# EAGLE design Layer2_v1.1 (EAGLE 6.2)
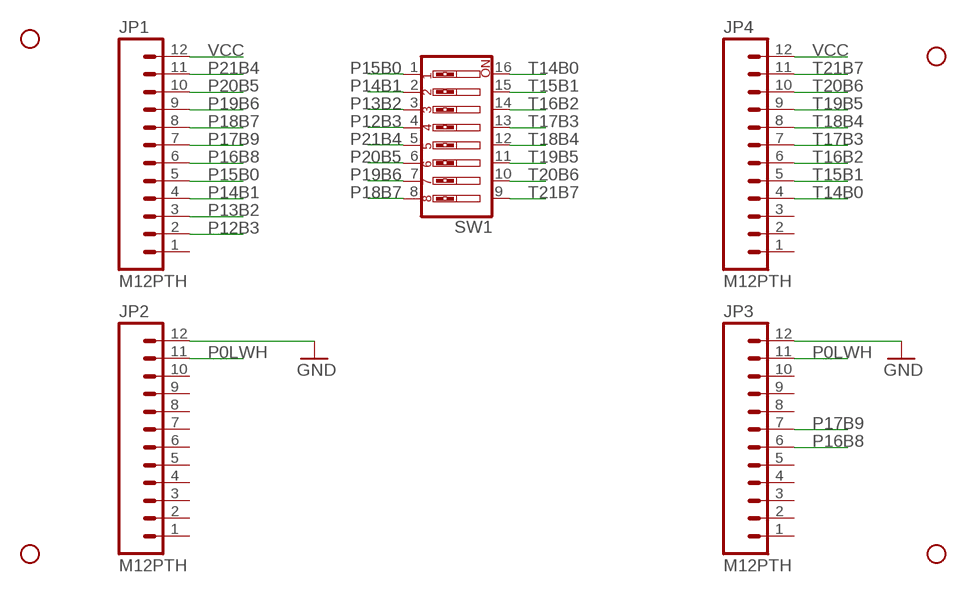
[diagram p0: schematic, sheet 1]

## Parts
JP1  M12PTH  [1X12]
JP2  M12PTH  [1X12]
JP3  M12PTH  [1X12]
JP4  M12PTH  [1X12]
JP5  STAND-OFF  [STAND-OFF]
JP6  STAND-OFF  [STAND-OFF]
JP7  STAND-OFF  [STAND-OFF]
JP8  STAND-OFF  [STAND-OFF]
SW1  SW_DIP-8  [DIPSWITCH-08]

## Nets
GND: JP2.12 JP3.12
P0LWH: JP2.11 JP3.11
P12B3: JP1.2 SW1.4
P13B2: JP1.3 SW1.3
P14B1: JP1.4 SW1.2
P15B0: JP1.5 SW1.1
P16B8: JP1.6 JP3.6
P17B9: JP1.7 JP3.7
P18B7: JP1.8 SW1.8
P19B6: JP1.9 SW1.7
P20B5: JP1.10 SW1.6
P21B4: JP1.11 SW1.5
T14B0: JP4.4 SW1.16
T15B1: JP4.5 SW1.15
T16B2: JP4.6 SW1.14
T17B3: JP4.7 SW1.13
T18B4: JP4.8 SW1.12
T19B5: JP4.9 SW1.11
T20B6: JP4.10 SW1.10
T21B7: JP4.11 SW1.9
VCC: JP1.12 JP4.12
Unconnected: JP1.1 JP2.1 JP2.2 JP2.3 JP2.4 JP2.5 JP2.6 JP2.7 JP2.8 JP2.9 JP2.10 JP3.1 JP3.2 JP3.3 JP3.4 JP3.5 JP3.8 JP3.9 JP3.10 JP4.1 JP4.2 JP4.3

## Library data of the parts
JP1-JP4 = SparkFun-Connectors:M12: Header 12 Standard 12-pin 0.1" header. Use with straight break away headers (SKU : PRT-00116), right angle break away headers (PRT-00553), swiss pins (PRT-00743), machine pins (PRT-00117), and female headers (PRT-00115).
JP5-JP8 = SparkFun-Electromechanical:STAND-OFF: #4 Stand Off This is the mechanical footprint for a #4 phillips button head screw. Use the keepout ring to avoid running the screw head into surrounding components. SKU : PRT-00447
SW1 = SparkFun-Electromechanical:SW_DIP-8: DIP Switch 8 Position Spark Fun Electronics SKU : COM-08034

## Board
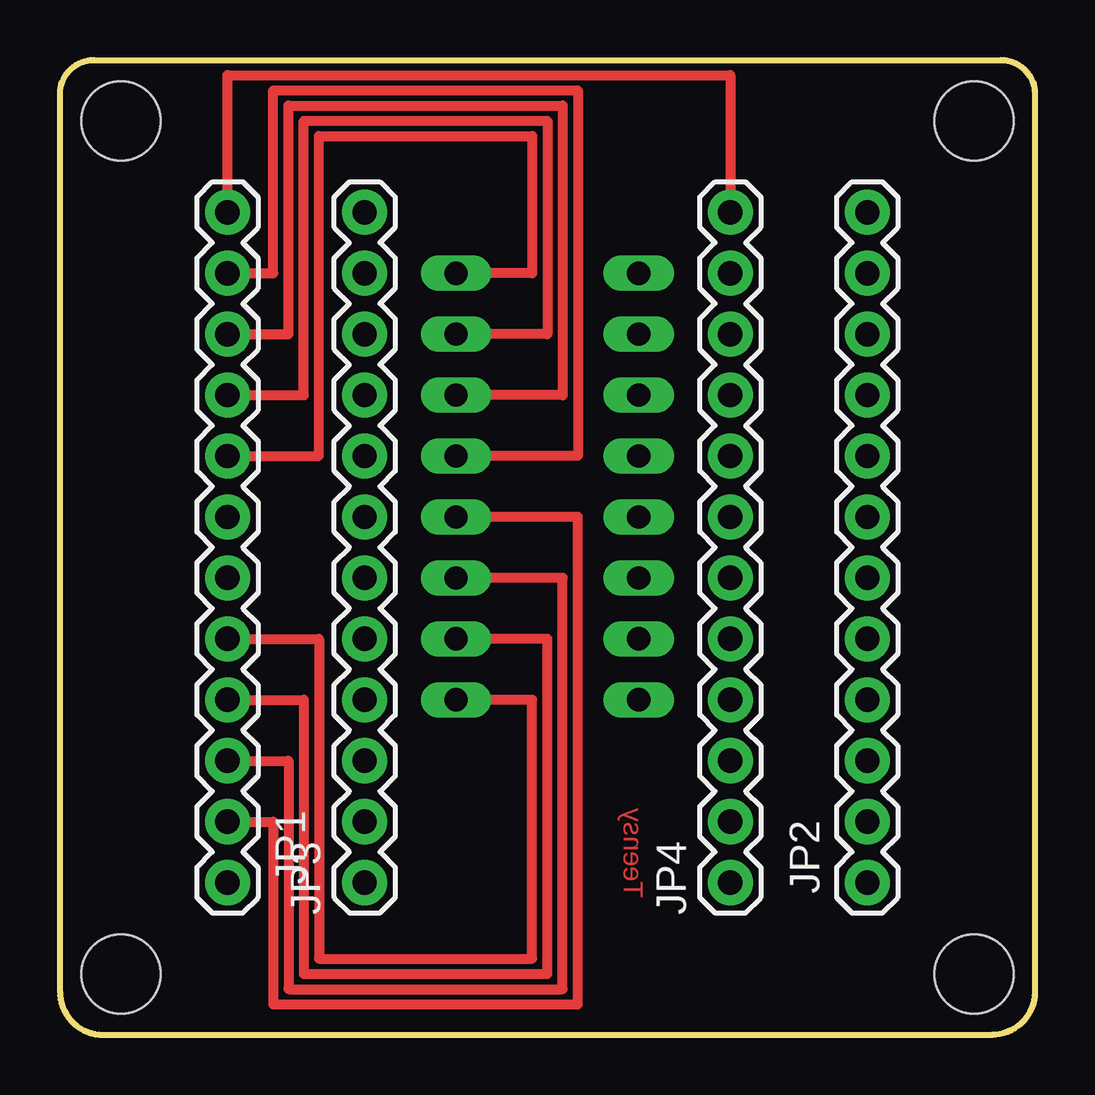
[diagram p1: board, top side]
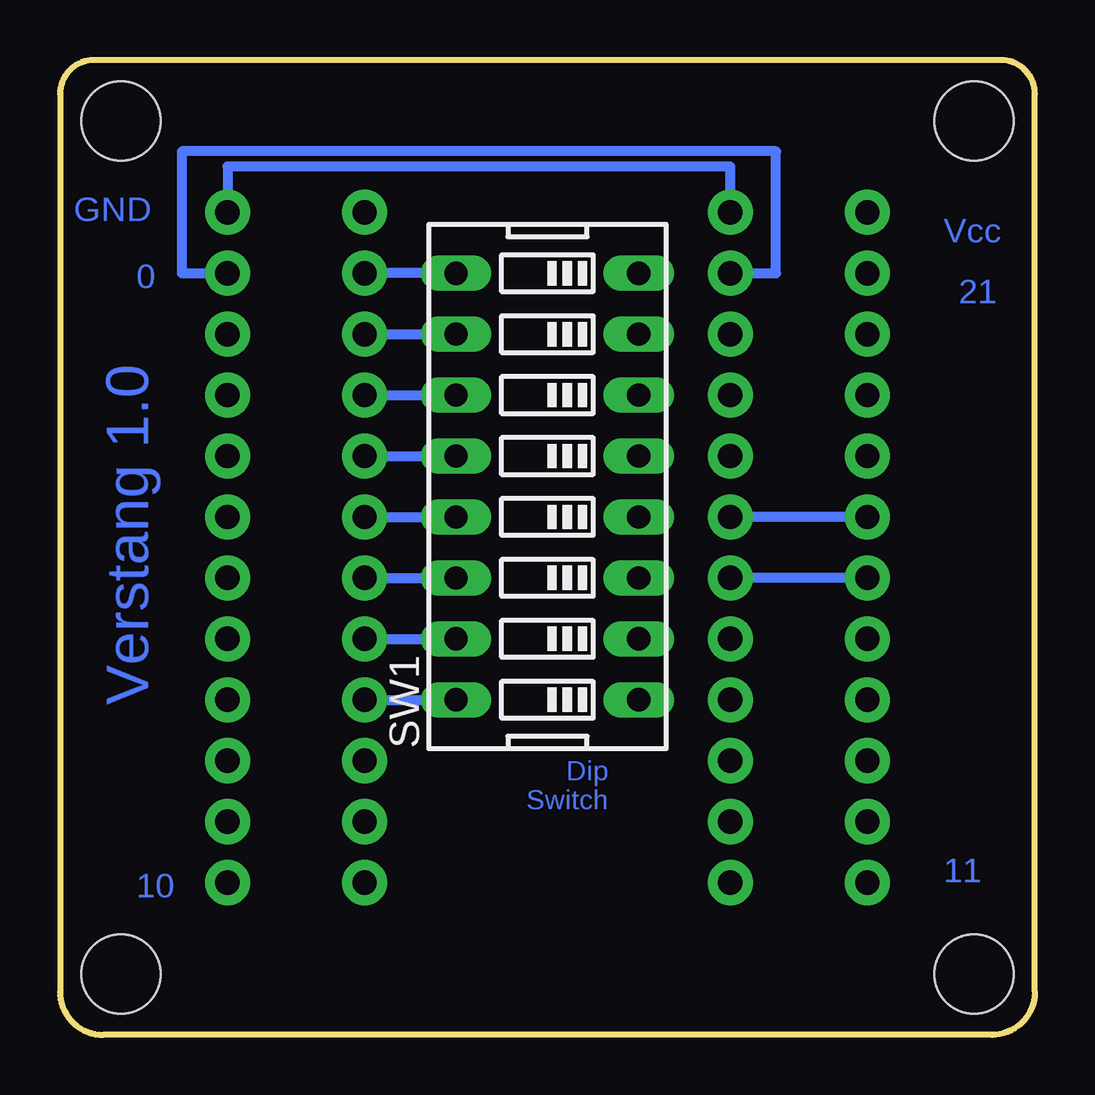
[diagram p2: board, bottom side, seen from below]

Size 40.64 x 40.64 mm. Coordinates in mm from the lower left corner, seen from the top.
Outline: 0,1.8 0,39.22 arc-90 1.42,40.64 39.22,40.64 arc-90 40.64,39.22 40.64,1.8 arc-90 38.84,0 1.8,0 arc-90 0,1.8
Copper layers (1*16): Top 0.035mm / dielectric 1.5mm / Bottom 0.035mm
Design rules "default": minimum track width 6mil, minimum drill 24mil, track to track 8mil, track to pad 8mil, pad to pad 8mil, via to via 8mil, smd to smd 8mil, copper to edge 40mil, drill to drill 8mil, minimum pad ring 10mil, minimum via ring 8mil, stop-mask expansion 4mil, vias tented up to drill 0mil, thermal gap 10mil

### Footprints (pad centres in the part's own frame; a part is rotated, then mirrored left to right if it is on the bottom)
1X12 = drill 1.016 pad 1.88: 1 0,0; 2 2.54,0; 3 5.08,0; 4 7.62,0; 5 10.16,0; 6 12.7,0; 7 15.24,0; 8 17.78,0; 9 20.32,0; 10 22.86,0; 11 25.4,0; 12 27.94,0
STAND-OFF = hole 3.302: 0,0
DIPSWITCH-08 = drill 0.97 long: 1 -8.89,-3.81; 2 -6.35,-3.81; 3 -3.81,-3.81; 4 -1.27,-3.81; 5 1.27,-3.81; 6 3.81,-3.81; 7 6.35,-3.81; 8 8.89,-3.81; 9 8.89,3.81; 10 6.35,3.81; 11 3.81,3.81; 12 1.27,3.81; 13 -1.27,3.81; 14 -3.81,3.81; 15 -6.35,3.81; 16 -8.89,3.81

### Placement (x,y rotation side)
JP1  6.99,6.35 90 top
JP2  33.66,6.35 90 top
JP3  12.7,6.35 90 top
JP4  27.94,6.35 90 top
JP5  2.54,38.1 0 top
JP6  38.1,38.1 0 top
JP7  38.1,2.54 0 top
JP8  2.54,2.54 0 top
SW1  20.32,22.86 90 bottom

### Tracks (layer width: path | path; a pad name or v marks a point on that pad's centre or on a via)
GND
  Bottom 0.406: JP3.12 12.7,36.2 33.66,36.2 JP2.12
P0LWH
  Bottom 0.406: JP3.11 10.79,31.75 10.79,36.83 35.56,36.83 35.56,31.75 JP2.11
P12B3
  Top 0.406: JP1.2 8.89,8.89 8.89,1.27 21.59,1.27 21.59,21.59 SW1.4
P13B2
  Top 0.406: JP1.3 9.53,11.43 9.53,1.91 20.95,1.91 20.95,19.05 SW1.3
P14B1
  Top 0.406: JP1.4 10.16,13.97 10.16,2.54 20.32,2.54 20.32,16.51 SW1.2
P15B0
  Top 0.406: JP1.5 10.79,16.51 10.79,3.17 19.68,3.17 19.68,13.97 SW1.1
P16B8
  Bottom 0.406: JP1.6 JP3.6
P17B9
  Bottom 0.406: JP1.7 JP3.7
P18B7
  Top 0.406: JP1.8 10.79,24.13 10.79,37.47 19.68,37.47 19.68,31.75 SW1.8
P19B6
  Top 0.406: JP1.9 10.16,26.67 10.16,38.1 20.32,38.1 20.32,29.21 SW1.7
P20B5
  Top 0.406: JP1.10 9.53,29.21 9.53,38.73 20.95,38.73 20.95,26.67 SW1.6
P21B4
  Top 0.406: JP1.11 8.89,31.75 8.89,39.37 21.59,39.37 21.59,24.13 SW1.5
T14B0
  Bottom 0.406: JP4.4 SW1.16
T15B1
  Bottom 0.406: JP4.5 SW1.15
T16B2
  Bottom 0.406: JP4.6 SW1.14
T17B3
  Bottom 0.406: JP4.7 SW1.13
T18B4
  Bottom 0.406: JP4.8 SW1.12
T19B5
  Bottom 0.406: JP4.9 SW1.11
T20B6
  Bottom 0.406: JP4.10 SW1.10
T21B7
  Bottom 0.406: SW1.9 JP4.11
VCC
  Top 0.406: JP1.12 6.99,40.01 27.94,40.01 JP4.12

### Text on the board
Top: Teensy
Bottom: GND | Vcc | 0 | 21 | Verstang 1.0 | Dip / Switch | 11 | 10